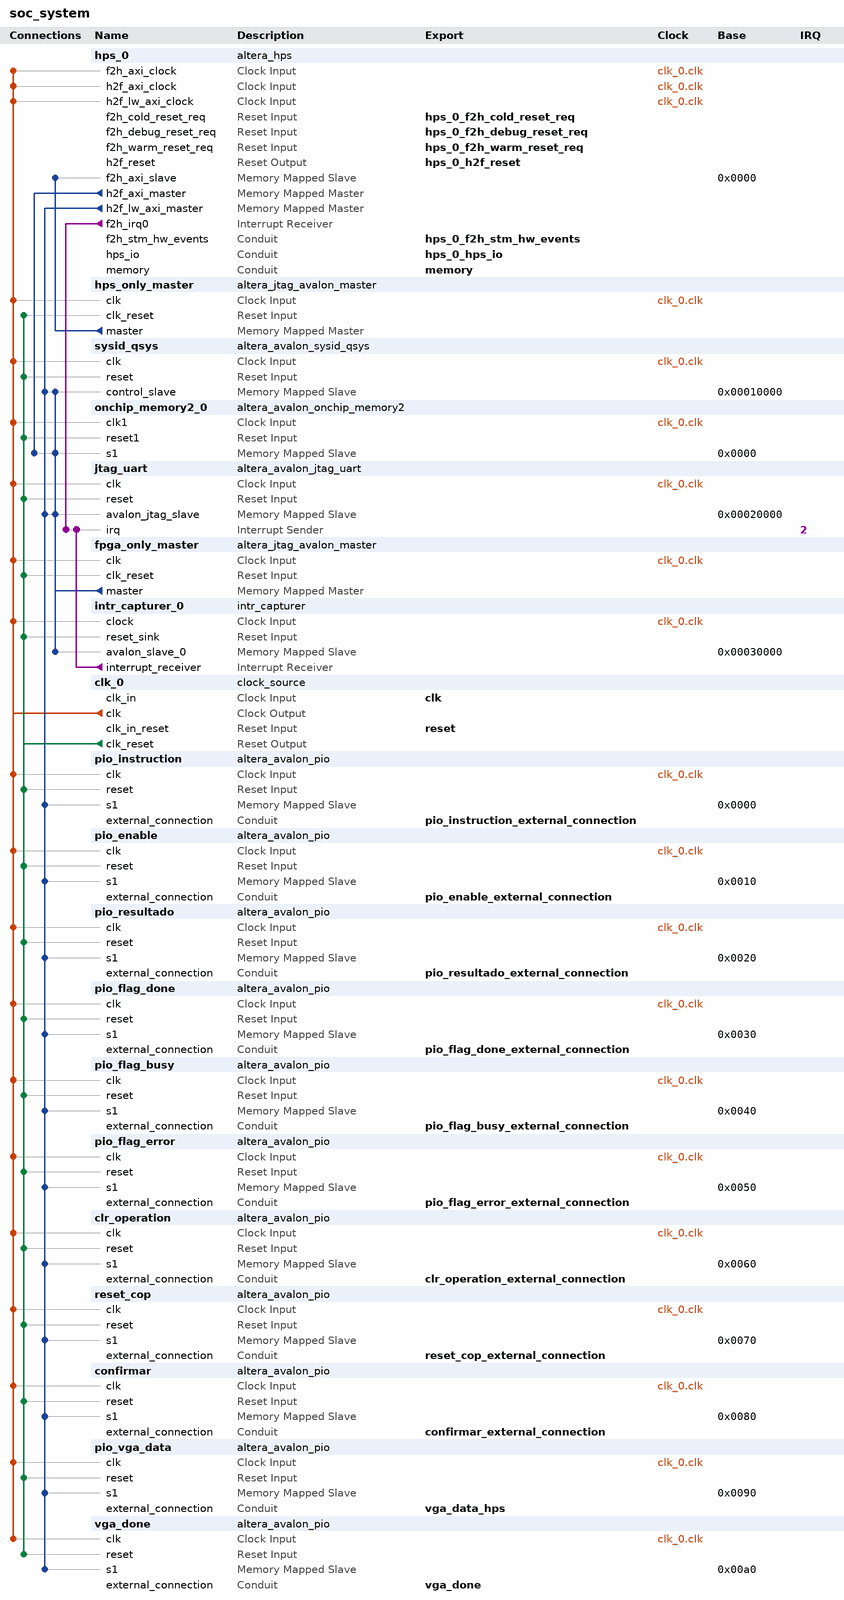
[diagram p0: system contents]
# Platform Designer (Qsys) system soc_system, Cyclone V 5CSEMA5F31C6
# Parameters at their usual value, and those the tool derives, are not listed.
package require -exact qsys 25.1
create_system soc_system
set_project_property DEVICE_FAMILY {Cyclone V}
set_project_property DEVICE 5CSEMA5F31C6

add_instance hps_0 altera_hps 25.1
set_instance_parameter_value hps_0 EMAC1_Mode RGMII
set_instance_parameter_value hps_0 EMAC1_PinMuxing {HPS I/O Set 0}
set_instance_parameter_value hps_0 F2SCLK_COLDRST_Enable true
set_instance_parameter_value hps_0 F2SCLK_DBGRST_Enable true
set_instance_parameter_value hps_0 F2SCLK_WARMRST_Enable true
set_instance_parameter_value hps_0 F2SINTERRUPT_Enable true
set_instance_parameter_value hps_0 F2S_Width 2
set_instance_parameter_value hps_0 FPGA_PERIPHERAL_OUTPUT_CLOCK_FREQ_EMAC0_GTX_CLK 100
set_instance_parameter_value hps_0 FPGA_PERIPHERAL_OUTPUT_CLOCK_FREQ_EMAC0_MD_CLK 100.0
set_instance_parameter_value hps_0 FPGA_PERIPHERAL_OUTPUT_CLOCK_FREQ_EMAC1_GTX_CLK 100
set_instance_parameter_value hps_0 FPGA_PERIPHERAL_OUTPUT_CLOCK_FREQ_EMAC1_MD_CLK 100.0
set_instance_parameter_value hps_0 HPS_PROTOCOL DDR3
set_instance_parameter_value hps_0 I2C0_Mode I2C
set_instance_parameter_value hps_0 I2C0_PinMuxing {HPS I/O Set 0}
set_instance_parameter_value hps_0 I2C1_Mode I2C
set_instance_parameter_value hps_0 I2C1_PinMuxing {HPS I/O Set 0}
set_instance_parameter_value hps_0 LWH2F_Enable true
set_instance_parameter_value hps_0 MEM_BANKADDR_WIDTH 3
set_instance_parameter_value hps_0 MEM_CLK_FREQ 400.0
set_instance_parameter_value hps_0 MEM_COL_ADDR_WIDTH 10
set_instance_parameter_value hps_0 MEM_DQ_WIDTH 32
set_instance_parameter_value hps_0 MEM_DRV_STR RZQ/7
set_instance_parameter_value hps_0 MEM_ROW_ADDR_WIDTH 15
set_instance_parameter_value hps_0 MEM_RTT_NOM RZQ/4
set_instance_parameter_value hps_0 MEM_RTT_WR RZQ/4
set_instance_parameter_value hps_0 MEM_TCL 11
set_instance_parameter_value hps_0 MEM_TFAW_NS 30.0
set_instance_parameter_value hps_0 MEM_TRAS_NS 35.0
set_instance_parameter_value hps_0 MEM_TRCD_NS 13.75
set_instance_parameter_value hps_0 MEM_TRFC_NS 260.0
set_instance_parameter_value hps_0 MEM_TRP_NS 13.75
set_instance_parameter_value hps_0 MEM_VENDOR JEDEC
set_instance_parameter_value hps_0 MEM_WTCL 8
set_instance_parameter_value hps_0 QSPI_Mode {1 SS}
set_instance_parameter_value hps_0 QSPI_PinMuxing {HPS I/O Set 0}
set_instance_parameter_value hps_0 REF_CLK_FREQ 25.0
set_instance_parameter_value hps_0 S2FCLK_USER2CLK 5
set_instance_parameter_value hps_0 S2F_Width 2
set_instance_parameter_value hps_0 SDIO_Mode {4-bit Data}
set_instance_parameter_value hps_0 SDIO_PinMuxing {HPS I/O Set 0}
set_instance_parameter_value hps_0 SPIM1_Mode {Single Slave Select}
set_instance_parameter_value hps_0 SPIM1_PinMuxing {HPS I/O Set 0}
set_instance_parameter_value hps_0 STM_Enable true
set_instance_parameter_value hps_0 TIMING_BOARD_AC_SKEW 0.03
set_instance_parameter_value hps_0 TIMING_BOARD_AC_TO_CK_SKEW 0.0
set_instance_parameter_value hps_0 TIMING_BOARD_DQ_TO_DQS_SKEW 0.0
set_instance_parameter_value hps_0 TIMING_BOARD_MAX_CK_DELAY 0.03
set_instance_parameter_value hps_0 TIMING_BOARD_MAX_DQS_DELAY 0.02
set_instance_parameter_value hps_0 TIMING_BOARD_SKEW_BETWEEN_DQS 0.08
set_instance_parameter_value hps_0 TIMING_BOARD_SKEW_CKDQS_DIMM_MAX 0.16
set_instance_parameter_value hps_0 TIMING_BOARD_SKEW_CKDQS_DIMM_MIN 0.09
set_instance_parameter_value hps_0 TIMING_BOARD_SKEW_WITHIN_DQS 0.01
set_instance_parameter_value hps_0 TIMING_TDH 65
set_instance_parameter_value hps_0 TIMING_TDQSCK 255
set_instance_parameter_value hps_0 TIMING_TDQSQ 125
set_instance_parameter_value hps_0 TIMING_TDS 30
set_instance_parameter_value hps_0 TIMING_TIH 140
set_instance_parameter_value hps_0 TIMING_TIS 180
set_instance_parameter_value hps_0 TIMING_TQSH 0.4
set_instance_parameter_value hps_0 UART0_Mode {No Flow Control}
set_instance_parameter_value hps_0 UART0_PinMuxing {HPS I/O Set 0}
set_instance_parameter_value hps_0 USB1_Mode SDR
set_instance_parameter_value hps_0 USB1_PinMuxing {HPS I/O Set 0}
set_instance_parameter_value hps_0 desired_cfg_clk_mhz 100.0
set_instance_parameter_value hps_0 desired_qspi_clk_mhz 400.0

add_instance hps_only_master altera_jtag_avalon_master 25.1

add_instance sysid_qsys altera_avalon_sysid_qsys 25.1
set_instance_parameter_value sysid_qsys id -1395322110

add_instance onchip_memory2_0 altera_avalon_onchip_memory2 25.1
set_instance_parameter_value onchip_memory2_0 dataWidth 64
set_instance_parameter_value onchip_memory2_0 dualPort false
set_instance_parameter_value onchip_memory2_0 initMemContent true
set_instance_parameter_value onchip_memory2_0 initializationFileName onchip_memory2_0
set_instance_parameter_value onchip_memory2_0 memorySize 65536

add_instance jtag_uart altera_avalon_jtag_uart 25.1
set_instance_parameter_value jtag_uart allowMultipleConnections true
set_instance_parameter_value jtag_uart simInteractiveOptions INTERACTIVE_ASCII_OUTPUT

add_instance fpga_only_master altera_jtag_avalon_master 25.1

add_instance intr_capturer_0 intr_capturer 100.99.98.97

add_instance clk_0 clock_source 25.1
set_instance_parameter_value clk_0 clockFrequency 50000000

add_instance pio_instruction altera_avalon_pio 25.1
set_instance_parameter_value pio_instruction direction Output
set_instance_parameter_value pio_instruction width 32

add_instance pio_enable altera_avalon_pio 25.1
set_instance_parameter_value pio_enable direction Output
set_instance_parameter_value pio_enable width 1

add_instance pio_resultado altera_avalon_pio 25.1
set_instance_parameter_value pio_resultado direction Input
set_instance_parameter_value pio_resultado width 4

add_instance pio_flag_done altera_avalon_pio 25.1
set_instance_parameter_value pio_flag_done direction Input
set_instance_parameter_value pio_flag_done width 1

add_instance pio_flag_busy altera_avalon_pio 25.1
set_instance_parameter_value pio_flag_busy direction Input
set_instance_parameter_value pio_flag_busy width 1

add_instance pio_flag_error altera_avalon_pio 25.1
set_instance_parameter_value pio_flag_error direction Input
set_instance_parameter_value pio_flag_error width 1

add_instance clr_operation altera_avalon_pio 25.1
set_instance_parameter_value clr_operation direction Output
set_instance_parameter_value clr_operation width 1

add_instance reset_cop altera_avalon_pio 25.1
set_instance_parameter_value reset_cop direction Output
set_instance_parameter_value reset_cop width 1

add_instance confirmar altera_avalon_pio 25.1
set_instance_parameter_value confirmar direction Input
set_instance_parameter_value confirmar width 32

add_instance pio_vga_data altera_avalon_pio 25.1
set_instance_parameter_value pio_vga_data direction Output
set_instance_parameter_value pio_vga_data width 32

add_instance vga_done altera_avalon_pio 25.1
set_instance_parameter_value vga_done direction Input
set_instance_parameter_value vga_done width 1

# connections
add_connection clk_0.clk clr_operation.clk clock
add_connection clk_0.clk confirmar.clk clock
add_connection clk_0.clk fpga_only_master.clk clock
add_connection clk_0.clk hps_0.f2h_axi_clock clock
add_connection clk_0.clk hps_0.h2f_axi_clock clock
add_connection clk_0.clk hps_0.h2f_lw_axi_clock clock
add_connection clk_0.clk hps_only_master.clk clock
add_connection clk_0.clk intr_capturer_0.clock clock
add_connection clk_0.clk jtag_uart.clk clock
add_connection clk_0.clk onchip_memory2_0.clk1 clock
add_connection clk_0.clk pio_enable.clk clock
add_connection clk_0.clk pio_flag_busy.clk clock
add_connection clk_0.clk pio_flag_done.clk clock
add_connection clk_0.clk pio_flag_error.clk clock
add_connection clk_0.clk pio_instruction.clk clock
add_connection clk_0.clk pio_resultado.clk clock
add_connection clk_0.clk pio_vga_data.clk clock
add_connection clk_0.clk reset_cop.clk clock
add_connection clk_0.clk sysid_qsys.clk clock
add_connection clk_0.clk vga_done.clk clock
add_connection clk_0.clk_reset clr_operation.reset reset
add_connection clk_0.clk_reset confirmar.reset reset
add_connection clk_0.clk_reset fpga_only_master.clk_reset reset
add_connection clk_0.clk_reset hps_only_master.clk_reset reset
add_connection clk_0.clk_reset intr_capturer_0.reset_sink reset
add_connection clk_0.clk_reset jtag_uart.reset reset
add_connection clk_0.clk_reset onchip_memory2_0.reset1 reset
add_connection clk_0.clk_reset pio_enable.reset reset
add_connection clk_0.clk_reset pio_flag_busy.reset reset
add_connection clk_0.clk_reset pio_flag_done.reset reset
add_connection clk_0.clk_reset pio_flag_error.reset reset
add_connection clk_0.clk_reset pio_instruction.reset reset
add_connection clk_0.clk_reset pio_resultado.reset reset
add_connection clk_0.clk_reset pio_vga_data.reset reset
add_connection clk_0.clk_reset reset_cop.reset reset
add_connection clk_0.clk_reset sysid_qsys.reset reset
add_connection clk_0.clk_reset vga_done.reset reset
add_connection fpga_only_master.master intr_capturer_0.avalon_slave_0 avalon
set_connection_parameter_value fpga_only_master.master/intr_capturer_0.avalon_slave_0 baseAddress 0x00030000
add_connection fpga_only_master.master jtag_uart.avalon_jtag_slave avalon
set_connection_parameter_value fpga_only_master.master/jtag_uart.avalon_jtag_slave baseAddress 0x00020000
add_connection fpga_only_master.master onchip_memory2_0.s1 avalon
set_connection_parameter_value fpga_only_master.master/onchip_memory2_0.s1 baseAddress 0x0000
add_connection fpga_only_master.master sysid_qsys.control_slave avalon
set_connection_parameter_value fpga_only_master.master/sysid_qsys.control_slave baseAddress 0x00010000
add_connection hps_0.h2f_axi_master onchip_memory2_0.s1 avalon
set_connection_parameter_value hps_0.h2f_axi_master/onchip_memory2_0.s1 baseAddress 0x0000
add_connection hps_0.h2f_lw_axi_master clr_operation.s1 avalon
set_connection_parameter_value hps_0.h2f_lw_axi_master/clr_operation.s1 baseAddress 0x0060
add_connection hps_0.h2f_lw_axi_master confirmar.s1 avalon
set_connection_parameter_value hps_0.h2f_lw_axi_master/confirmar.s1 baseAddress 0x0080
add_connection hps_0.h2f_lw_axi_master jtag_uart.avalon_jtag_slave avalon
set_connection_parameter_value hps_0.h2f_lw_axi_master/jtag_uart.avalon_jtag_slave baseAddress 0x00020000
add_connection hps_0.h2f_lw_axi_master pio_enable.s1 avalon
set_connection_parameter_value hps_0.h2f_lw_axi_master/pio_enable.s1 baseAddress 0x0010
add_connection hps_0.h2f_lw_axi_master pio_flag_busy.s1 avalon
set_connection_parameter_value hps_0.h2f_lw_axi_master/pio_flag_busy.s1 baseAddress 0x0040
add_connection hps_0.h2f_lw_axi_master pio_flag_done.s1 avalon
set_connection_parameter_value hps_0.h2f_lw_axi_master/pio_flag_done.s1 baseAddress 0x0030
add_connection hps_0.h2f_lw_axi_master pio_flag_error.s1 avalon
set_connection_parameter_value hps_0.h2f_lw_axi_master/pio_flag_error.s1 baseAddress 0x0050
add_connection hps_0.h2f_lw_axi_master pio_instruction.s1 avalon
set_connection_parameter_value hps_0.h2f_lw_axi_master/pio_instruction.s1 baseAddress 0x0000
add_connection hps_0.h2f_lw_axi_master pio_resultado.s1 avalon
set_connection_parameter_value hps_0.h2f_lw_axi_master/pio_resultado.s1 baseAddress 0x0020
add_connection hps_0.h2f_lw_axi_master pio_vga_data.s1 avalon
set_connection_parameter_value hps_0.h2f_lw_axi_master/pio_vga_data.s1 baseAddress 0x0090
add_connection hps_0.h2f_lw_axi_master reset_cop.s1 avalon
set_connection_parameter_value hps_0.h2f_lw_axi_master/reset_cop.s1 baseAddress 0x0070
add_connection hps_0.h2f_lw_axi_master sysid_qsys.control_slave avalon
set_connection_parameter_value hps_0.h2f_lw_axi_master/sysid_qsys.control_slave baseAddress 0x00010000
add_connection hps_0.h2f_lw_axi_master vga_done.s1 avalon
set_connection_parameter_value hps_0.h2f_lw_axi_master/vga_done.s1 baseAddress 0x00a0
add_connection hps_only_master.master hps_0.f2h_axi_slave avalon
set_connection_parameter_value hps_only_master.master/hps_0.f2h_axi_slave baseAddress 0x0000
add_connection hps_0.f2h_irq0 jtag_uart.irq interrupt
set_connection_parameter_value hps_0.f2h_irq0/jtag_uart.irq irqNumber 2
add_connection intr_capturer_0.interrupt_receiver jtag_uart.irq interrupt
set_connection_parameter_value intr_capturer_0.interrupt_receiver/jtag_uart.irq irqNumber 2

# exported interfaces
add_interface clk clock sink
set_interface_property clk EXPORT_OF clk_0.clk_in
add_interface clr_operation_external_connection conduit end
set_interface_property clr_operation_external_connection EXPORT_OF clr_operation.external_connection
add_interface confirmar_external_connection conduit end
set_interface_property confirmar_external_connection EXPORT_OF confirmar.external_connection
add_interface hps_0_f2h_cold_reset_req reset sink
set_interface_property hps_0_f2h_cold_reset_req EXPORT_OF hps_0.f2h_cold_reset_req
add_interface hps_0_f2h_debug_reset_req reset sink
set_interface_property hps_0_f2h_debug_reset_req EXPORT_OF hps_0.f2h_debug_reset_req
add_interface hps_0_f2h_stm_hw_events conduit end
set_interface_property hps_0_f2h_stm_hw_events EXPORT_OF hps_0.f2h_stm_hw_events
add_interface hps_0_f2h_warm_reset_req reset sink
set_interface_property hps_0_f2h_warm_reset_req EXPORT_OF hps_0.f2h_warm_reset_req
add_interface hps_0_h2f_reset reset source
set_interface_property hps_0_h2f_reset EXPORT_OF hps_0.h2f_reset
add_interface hps_0_hps_io conduit end
set_interface_property hps_0_hps_io EXPORT_OF hps_0.hps_io
add_interface memory conduit end
set_interface_property memory EXPORT_OF hps_0.memory
add_interface pio_enable_external_connection conduit end
set_interface_property pio_enable_external_connection EXPORT_OF pio_enable.external_connection
add_interface pio_flag_busy_external_connection conduit end
set_interface_property pio_flag_busy_external_connection EXPORT_OF pio_flag_busy.external_connection
add_interface pio_flag_done_external_connection conduit end
set_interface_property pio_flag_done_external_connection EXPORT_OF pio_flag_done.external_connection
add_interface pio_flag_error_external_connection conduit end
set_interface_property pio_flag_error_external_connection EXPORT_OF pio_flag_error.external_connection
add_interface pio_instruction_external_connection conduit end
set_interface_property pio_instruction_external_connection EXPORT_OF pio_instruction.external_connection
add_interface pio_resultado_external_connection conduit end
set_interface_property pio_resultado_external_connection EXPORT_OF pio_resultado.external_connection
add_interface reset reset sink
set_interface_property reset EXPORT_OF clk_0.clk_in_reset
add_interface reset_cop_external_connection conduit end
set_interface_property reset_cop_external_connection EXPORT_OF reset_cop.external_connection
add_interface vga_data_hps conduit end
set_interface_property vga_data_hps EXPORT_OF pio_vga_data.external_connection
add_interface vga_done conduit end
set_interface_property vga_done EXPORT_OF vga_done.external_connection

set_interconnect_requirement {$system} qsys_mm.clockCrossingAdapter HANDSHAKE
set_interconnect_requirement {$system} qsys_mm.maxAdditionalLatency 1

save_system soc_system.qsys
